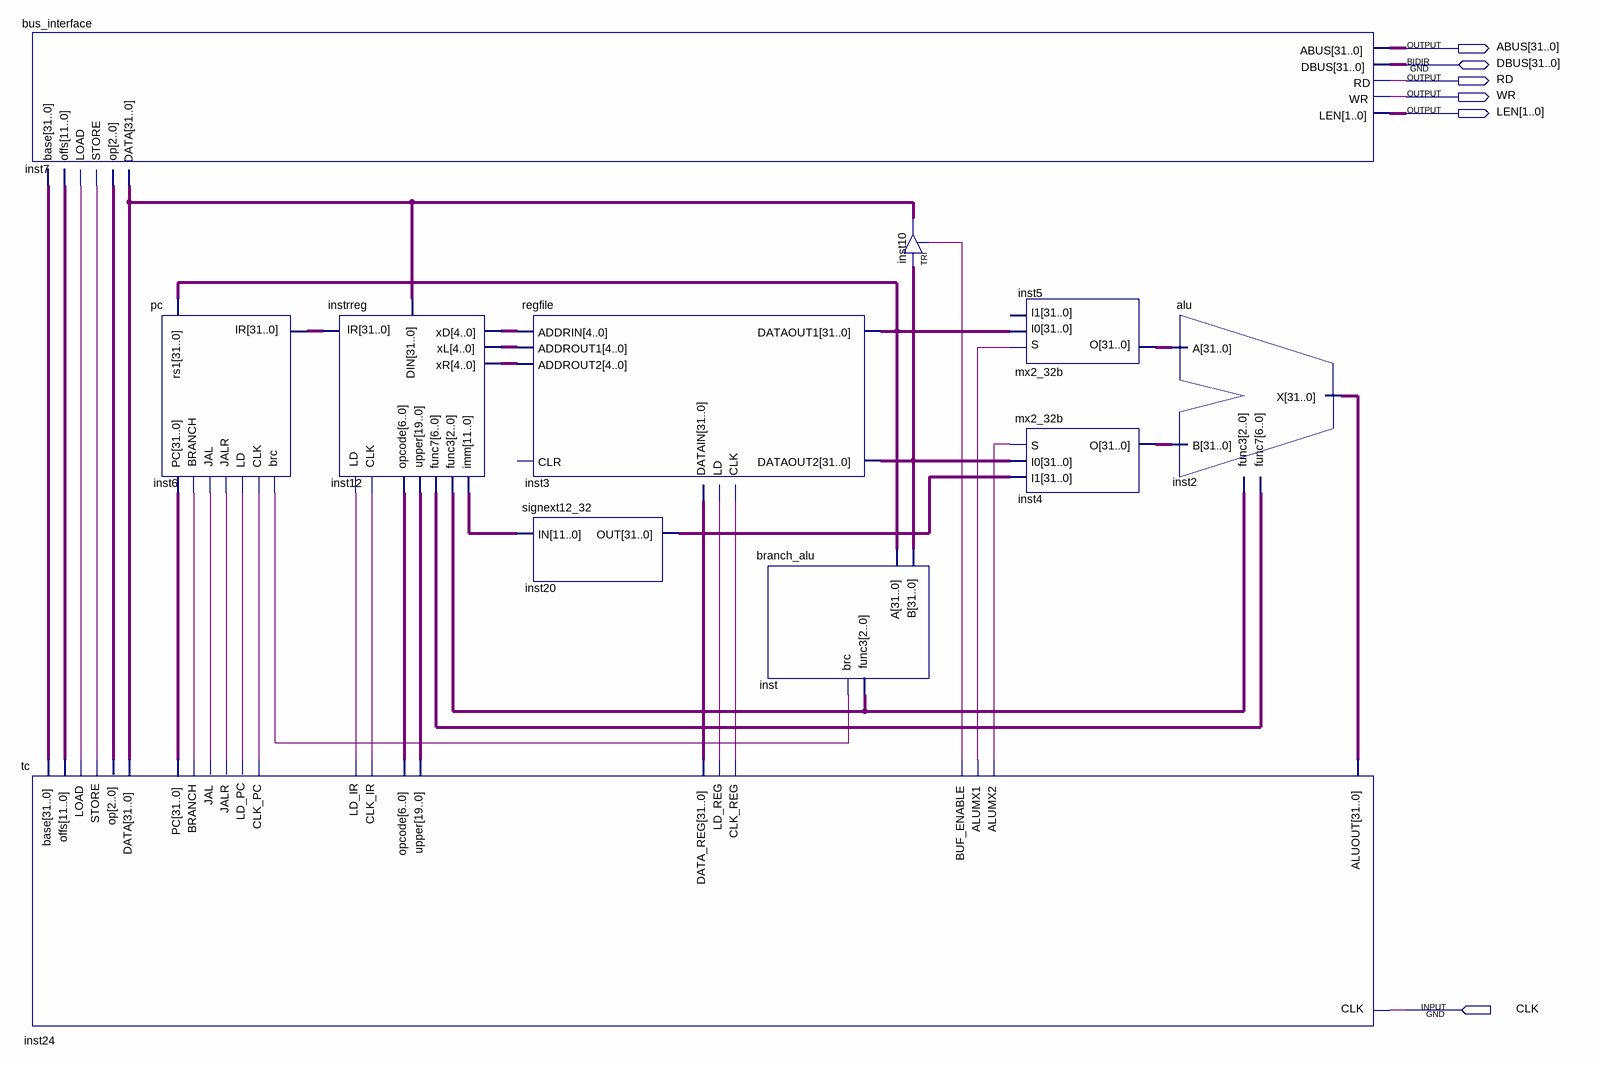
[diagram p0: schematic sheet]
// Quartus schematic cpu.bdf as structural Verilog: 11 symbols, 6 pins
module cpu (
  input  CLK,
  inout  [31:0] DBUS,
  output [31:0] ABUS,
  output RD,
  output WR,
  output [1:0] LEN
);

  wire inst24_alumx1, inst24_alumx2, inst24_branch, inst24_buf_enable, inst24_clk_ir, inst24_clk_pc,
       inst24_clk_reg, inst24_jal, inst24_jalr, inst24_ld_ir, inst24_ld_pc, inst24_ld_reg, inst24_load,
       inst24_store, inst_brc;
  wire [2:0] inst12_func3, inst24_op;
  wire [4:0] inst12_xd, inst12_xl, inst12_xr;
  wire [6:0] inst12_func7, inst12_opcode;
  wire [11:0] inst12_imm, inst24_offs;
  wire [19:0] inst12_upper;
  wire [31:0] inst2_x, inst3_dataout1, inst3_dataout2, inst4_o, inst5_o, inst6_pc, inst7_data, inst12_ir,
       inst20_out, inst24_base, inst24_data_reg;

  bus_interface inst7 (
    .base(inst24_base), .offs(inst24_offs), .LOAD(inst24_load), .STORE(inst24_store), .op(inst24_op),
    .ABUS(ABUS), .RD(RD), .WR(WR), .LEN(LEN), .DBUS(DBUS), .DATA(inst7_data));
  tc inst24 (
    .ALUOUT(inst2_x), .DATA(inst7_data), .PC(inst6_pc), .opcode(inst12_opcode), .upper(inst12_upper),
    .CLK(CLK), .DATA_REG(inst24_data_reg), .base(inst24_base), .offs(inst24_offs), .LOAD(inst24_load),
    .STORE(inst24_store), .op(inst24_op), .BRANCH(inst24_branch), .JAL(inst24_jal), .JALR(inst24_jalr),
    .LD_PC(inst24_ld_pc), .CLK_PC(inst24_clk_pc), .LD_IR(inst24_ld_ir), .CLK_IR(inst24_clk_ir),
    .LD_REG(inst24_ld_reg), .CLK_REG(inst24_clk_reg), .BUF_ENABLE(inst24_buf_enable), .ALUMX2(inst24_alumx2),
    .ALUMX1(inst24_alumx1));
  pc inst6 (
    .brc(inst_brc), .BRANCH(inst24_branch), .JAL(inst24_jal), .JALR(inst24_jalr), .IR(inst12_ir),
    .rs1(inst3_dataout1), .LD(inst24_ld_pc), .CLK(inst24_clk_pc), .PC(inst6_pc));
  instrreg inst12 (
    .DIN(inst7_data), .LD(inst24_ld_ir), .CLK(inst24_clk_ir), .IR(inst12_ir), .opcode(inst12_opcode),
    .func7(inst12_func7), .xR(inst12_xr), .xL(inst12_xl), .func3(inst12_func3), .xD(inst12_xd),
    .imm(inst12_imm), .upper(inst12_upper));
  regfile inst3 (
    .LD(inst24_ld_reg), .ADDRIN(inst12_xd), .DATAIN(inst24_data_reg), .CLK(inst24_clk_reg),
    .ADDROUT1(inst12_xl), .ADDROUT2(inst12_xr), .DATAOUT2(inst3_dataout2), .DATAOUT1(inst3_dataout1));  // open: CLR
  signext12_32 inst20 (.IN(inst12_imm), .OUT(inst20_out));
  branch_alu inst (.A(inst3_dataout1), .B(inst3_dataout2), .func3(inst12_func3), .brc(inst_brc));
  TRI inst10[31:0] (.IN(inst3_dataout2), .OE(inst24_buf_enable), .OUT(inst7_data));
  mx2_32b inst5 (.S(inst24_alumx1), .I0(inst3_dataout1), .O(inst5_o));  // open: I1
  mx2_32b inst4 (.S(inst24_alumx2), .I0(inst3_dataout2), .I1(inst20_out), .O(inst4_o));
  alu inst2 (.func3(inst12_func3), .A(inst5_o), .B(inst4_o), .func7(inst12_func7), .X(inst2_x));
endmodule
